# EAGLE design gpi-filter0 (EAGLE 7.5.0)
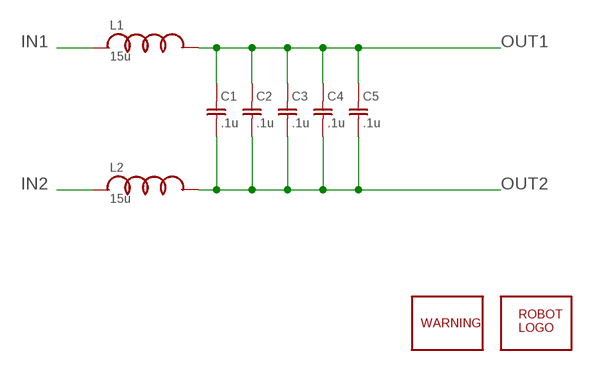
[diagram p0: schematic, sheet 1]

## Parts
C1  .1u  C1210  [SMD1210]
C2  .1u  C1210  [SMD1210]
C3  .1u  C1210  [SMD1210]
C4  .1u  C1210  [SMD1210]
C5  .1u  C1210  [SMD1210]
L1  15u  L  [BOURNS2303H]
L2  15u  L  [BOURNS2303H]
U$1  ROBOTMAN-LOGO  [ROBOTMAN-LOGO]
U$2  SYMBOL-WARNING  [SYMBOL-WARNING]

## Nets
IN1: L1.P$1
IN2: L2.P$1
OUT1: C1.1 C2.1 C3.1 C4.1 C5.1 L1.P$2
OUT2: C1.2 C2.2 C3.2 C4.2 C5.2 L2.P$2

## Library data of the parts
C1-C5 = jaw:C
L1 L2 = jaw:L
U$1 = jaw:ROBOTMAN-LOGO
U$2 = jaw:SYMBOL-WARNING

## Board
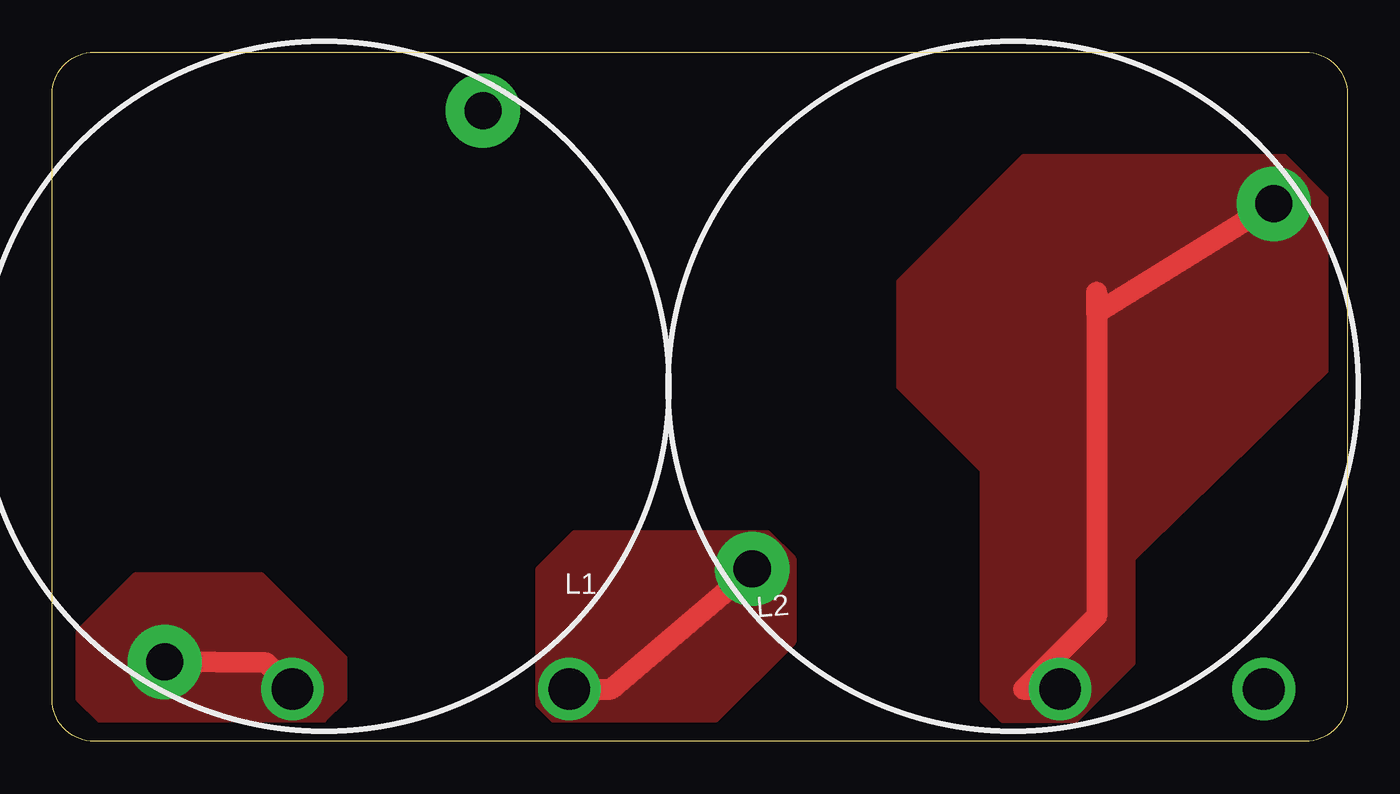
[diagram p1: board, top side]
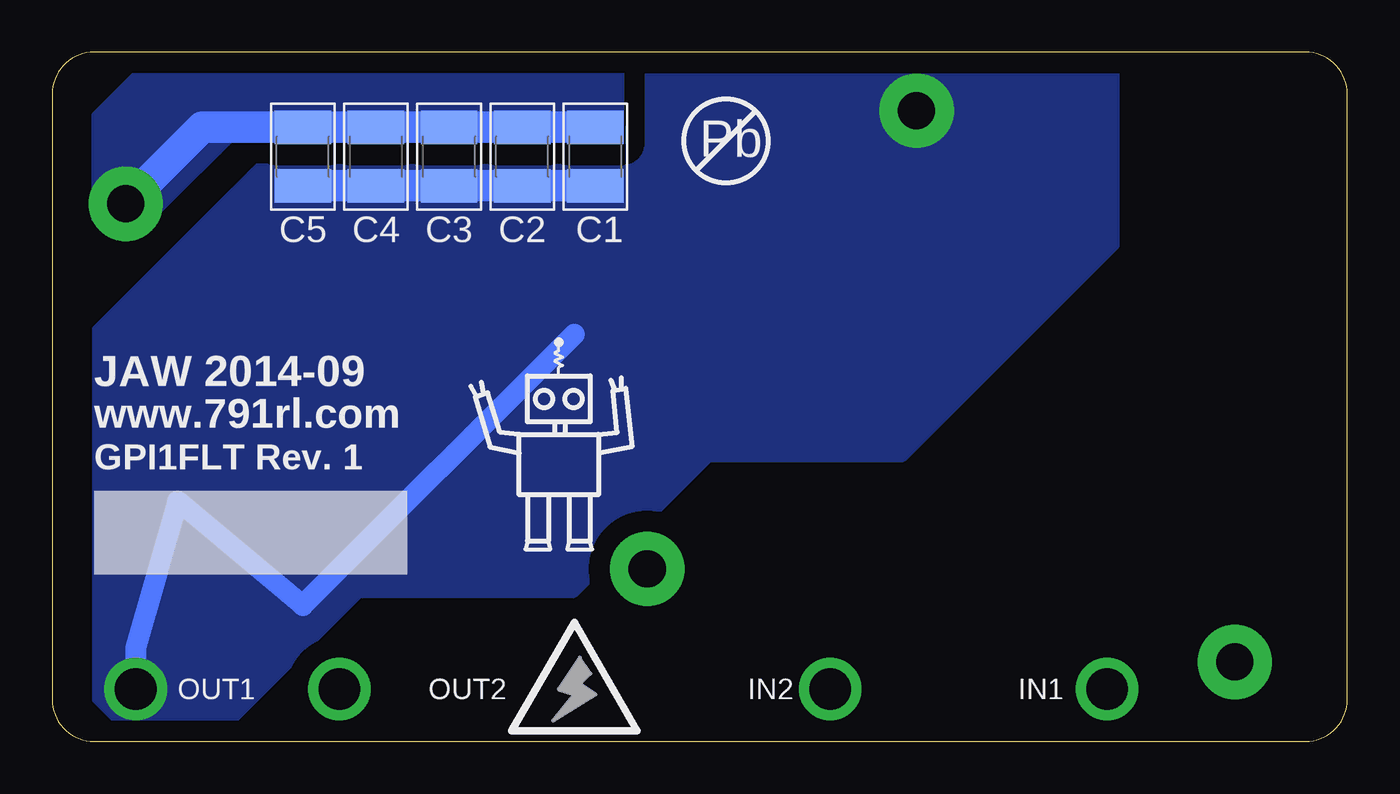
[diagram p2: board, bottom side, seen from below]

Size 62 x 33 mm. Coordinates in mm from the lower left corner, seen from the top.
Outline: 0,2 0,31 arc-90 2,33 60,33 arc-90 62,31 62,2 arc-90 60,0 2,0 arc-90 0,2
Copper layers (1*16): Top 0.0356mm / dielectric 1.5011mm / Bottom 0.0356mm
Design rules "LaenPCBOrder *": minimum track width 6mil, minimum drill 13mil, track to track 6mil, track to pad 6mil, pad to pad 6mil, via to via 6mil, smd to smd 6mil, copper to edge 15mil, drill to drill 6mil, minimum pad ring 7mil, minimum via ring 7mil, stop-mask expansion 4mil, vias tented up to drill 1.5mm, thermal gap 10mil

### Footprints (pad centres in the part's own frame; a part is rotated, then mirrored left to right if it is on the bottom)
SMD1210 = smd 1.6 x 2.7: 1 -1.4,0; 2 1.4,0
BOURNS2303H = drill 1.778 pad 3.556: P$1 -15.24,0; P$2 15.24,0

### Placement (x,y rotation side)
C1  36,28 90 bottom
C2  39.5,28 90 bottom
C3  43,28 90 bottom
C4  46.5,28 90 bottom
C5  50,28 90 bottom
L1  13,17 60 top
L2  46,17 35 top
U$1  37.75,13.5 0 bottom
U$2  37,2.5 0 bottom

### Tracks (layer width: path | path; a pad name or v marks a point on that pad's centre or on a via)
IN1  (via drill 2)
  Top 1: v11.5,2.5 10.25,3.75 L1.P$1
  pour Top (no thermals): 14,4 14,2 13,1 2.25,1 1.25,2 1.25,5.25 4,8 10,8
IN2  (via drill 2)
  Top 1: v24.75,2.5 26.75,2.5 L2.P$1
  pour Top (no thermals): 35.5,8.75 35.5,4.75 31.75,1 24,1 23.25,1.75 23.25,8.25 25,10 34.25,10
OUT1  (via drill 2 pad 3)
  Bottom 1: 37,19.5 50,6.5 56,11.5 58,4.5 v58,2.5
  Bottom 1.5: C5.1 C4.1 C3.1 C2.1 C1.1
  pour Bottom (isolate 1, rank 2, no thermals): 11,32 47.75,32 60,19.75 60,2 59,1 53.25,1 47.25,7 37,7 30.5,13.5 21.25,13.5 11,23.75
OUT2  (via drill 2 pad 3)
  Top 1: L2.P$2 50,20.5 | 50,20.5 50,21.5 50,20.5 | 50,20.5 50,6 46.5,2.5 v48.25,2.5
  Bottom 1.5: C1.2 C2.2 C3.2 C4.2 C5.2 54.83,29.4 L2.P$2
  pour Top (no thermals): 40.5,17 44.5,13 44.5,2 45.5,1 49,1 51.75,3.75 51.75,8.75 61,17.75 61,26 59,28 46.5,28 40.5,22
  pour Bottom (isolate 1, no thermals): 34.75,33 34.75,29.5 52.75,29.5 57.25,25 60,25 60,30 57,33

### Text on the board
bPlace: Pb | JAW 2014-09 | www.791rl.com | GPI1FLT Rev. 1 | IN2 | OUT1 | IN1 | OUT2